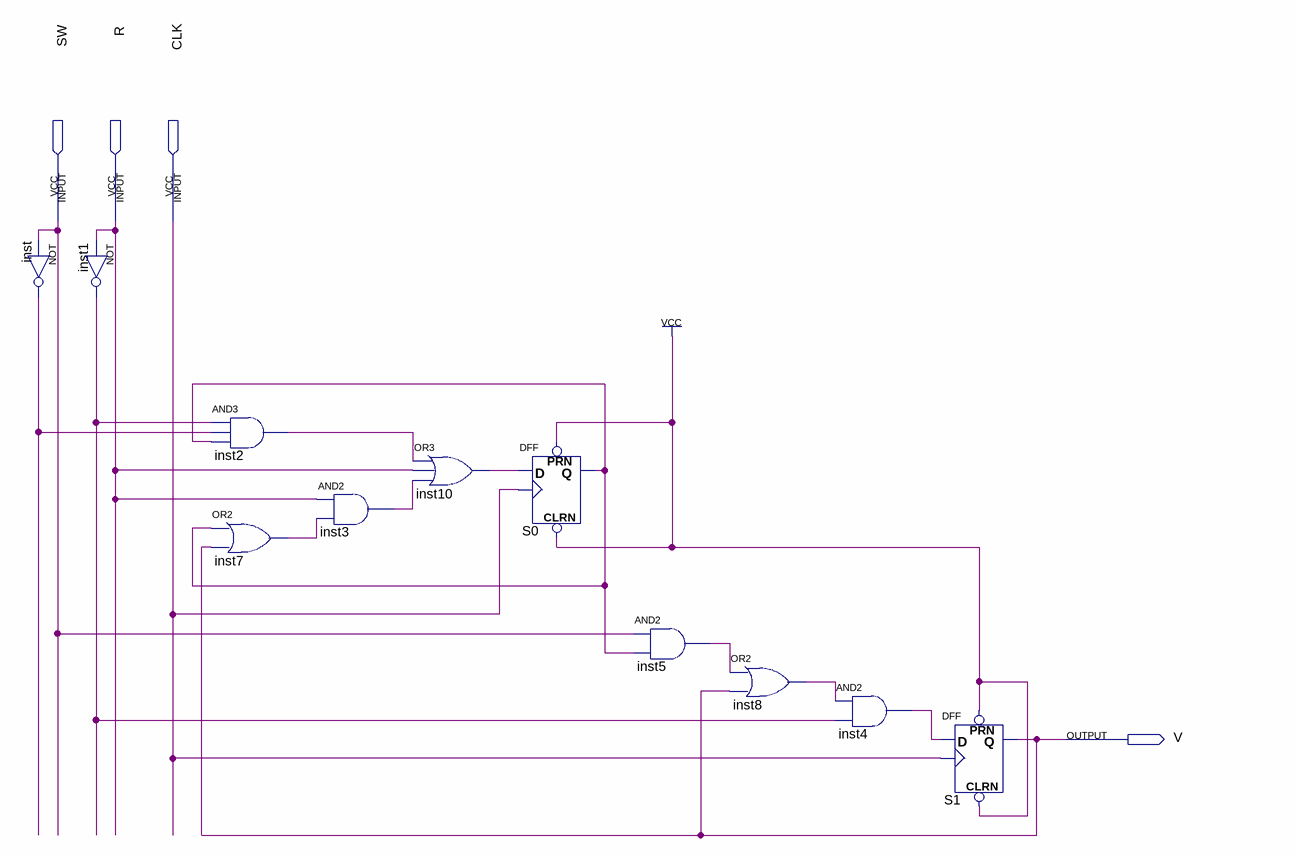
[diagram p0: schematic sheet]
// Quartus schematic sword.bdf as structural Verilog: 11 symbols, 4 pins
module sword (
  input  SW,
  input  R,
  input  CLK,
  output V
);

  wire inst1_out, inst2_out, inst3_out, inst4_out, inst5_out, inst7_out, inst8_out, inst10_out, inst_out,
       S0_q;

  not inst (inst_out, SW);
  not inst1 (inst1_out, R);
  and inst2 (inst2_out, inst1_out, inst_out, S0_q);
  or inst7 (inst7_out, S0_q, V);
  and inst3 (inst3_out, R, inst7_out);
  or inst10 (inst10_out, inst2_out, R, inst3_out);
  DFF S0 (.CLRN(1'b1), .CLK(CLK), .D(inst10_out), .PRN(1'b1), .Q(S0_q));
  and inst5 (inst5_out, SW, S0_q);
  or inst8 (inst8_out, inst5_out, V);
  and inst4 (inst4_out, inst8_out, inst1_out);
  DFF S1 (.CLRN(1'b1), .CLK(CLK), .D(inst4_out), .PRN(1'b1), .Q(V));
endmodule
